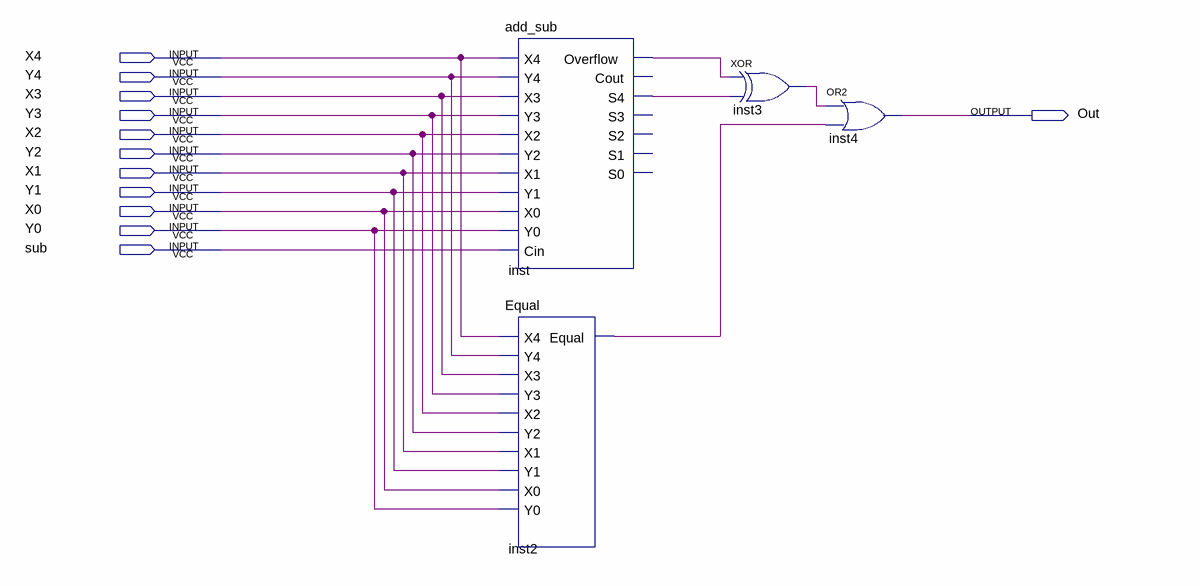
[diagram p0: schematic sheet]
// Quartus schematic comparator.bdf as structural Verilog: 4 symbols, 12 pins
module comparator (
  input  X4,
  input  Y4,
  input  X3,
  input  Y3,
  input  X2,
  input  Y2,
  input  X1,
  input  Y1,
  input  X0,
  input  Y0,
  input  sub,
  output Out
);

  wire inst2_equal, inst3_out, inst_overflow, inst_s4;

  add_sub inst (
    .X4(X4), .Y4(Y4), .X3(X3), .Y3(Y3), .X2(X2), .Y2(Y2), .X1(X1), .Y1(Y1), .X0(X0), .Y0(Y0), .Cin(sub),
    .Overflow(inst_overflow), .S4(inst_s4));  // open: Cout, S3, S2, S1, S0
  Equal inst2 (
    .X4(X4), .Y4(Y4), .X3(X3), .Y3(Y3), .X2(X2), .Y2(Y2), .X1(X1), .Y1(Y1), .X0(X0), .Y0(Y0),
    .Equal(inst2_equal));
  xor inst3 (inst3_out, inst_overflow, inst_s4);
  or inst4 (Out, inst3_out, inst2_equal);
endmodule
